# Altium schematic sheet FPGA SDRAM.SchDoc: Cart
size Tabloid; ApprovedBy: NA; CompanyName: Cospan Design LLC; DrawnBy: David McCoy; Engineer: David McCoy; DocumentNumber: 12; Revision: A; SheetNumber: 12; SheetTotal: 18; Client: OSH; Project: Guppy Buddy; ProjectPrettyName: Guppy Buddy
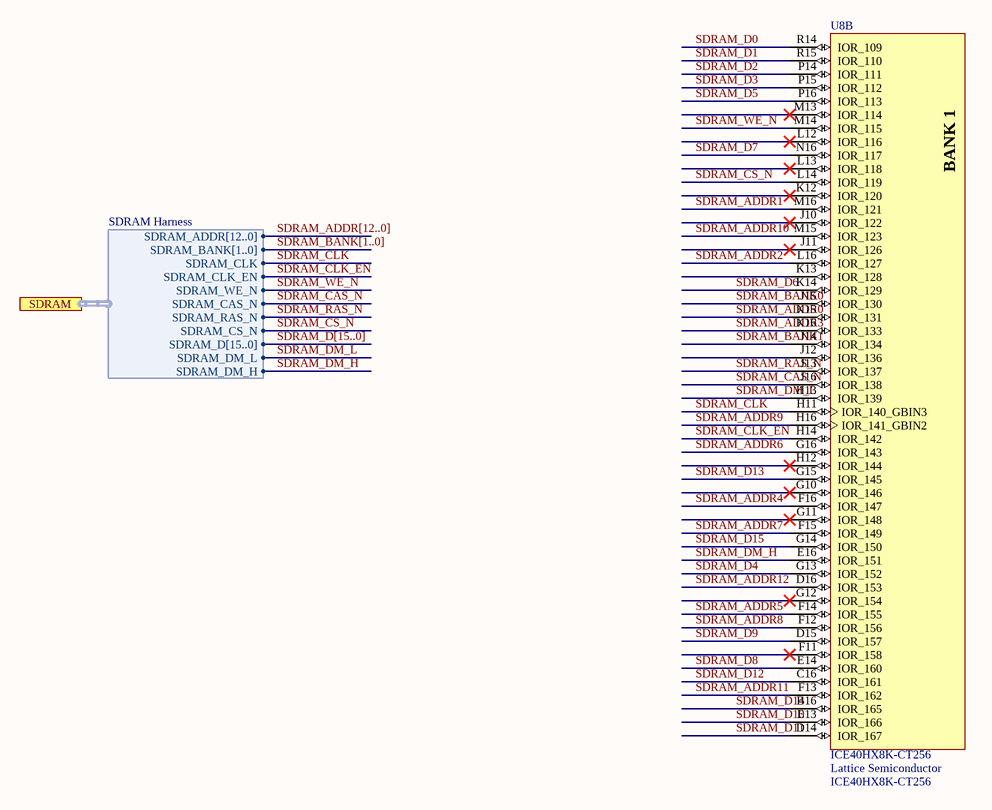
[diagram p0: FPGA SDRAM.SchDoc]

## Parts
U8  ICE40HX8K-CT256  Manufacturer 1: Lattice Semiconductor  [LATC-caBGA-256]  (part B of 5)

## Ports
SDRAM (harness SDRAM Harness)

## Harnesses
SDRAM Harness: SDRAM_ADDR[12..0], SDRAM_BANK[1..0], SDRAM_CLK, SDRAM_CLK_EN, SDRAM_WE_N, SDRAM_CAS_N, SDRAM_RAS_N, SDRAM_CS_N, SDRAM_D[15..0], SDRAM_DM_L, SDRAM_DM_H

## Nets
SDRAM_ADDR0: U8.K15(IOR_131)
SDRAM_ADDR1: U8.M16(IOR_121)
SDRAM_ADDR2: U8.L16(IOR_127)
SDRAM_ADDR3: U8.K16(IOR_133)
SDRAM_ADDR4: U8.F16(IOR_147)
SDRAM_ADDR5: U8.F14(IOR_155)
SDRAM_ADDR6: U8.G16(IOR_143)
SDRAM_ADDR7: U8.F15(IOR_149)
SDRAM_ADDR8: U8.F12(IOR_156)
SDRAM_ADDR9: U8.H16(IOR_141_GBIN2)
SDRAM_ADDR10: U8.M15(IOR_123)
SDRAM_ADDR11: U8.F13(IOR_162)
SDRAM_ADDR12: U8.D16(IOR_153)
SDRAM_BANK0: U8.J15(IOR_130)
SDRAM_BANK1: U8.J14(IOR_134)
SDRAM_CAS_N: U8.J16(IOR_138) ; port SDRAM.SDRAM_CAS_N
SDRAM_CLK: U8.H11(IOR_140_GBIN3) ; port SDRAM.SDRAM_CLK
SDRAM_CLK_EN: U8.H14(IOR_142) ; port SDRAM.SDRAM_CLK_EN
SDRAM_CS_N: U8.L14(IOR_119) ; port SDRAM.SDRAM_CS_N
SDRAM_D0: U8.R14(IOR_109)
SDRAM_D1: U8.R15(IOR_110)
SDRAM_D2: U8.P14(IOR_111)
SDRAM_D3: U8.P15(IOR_112)
SDRAM_D4: U8.G13(IOR_152)
SDRAM_D5: U8.P16(IOR_113)
SDRAM_D6: U8.K14(IOR_129)
SDRAM_D7: U8.N16(IOR_117)
SDRAM_D8: U8.E14(IOR_160)
SDRAM_D9: U8.D15(IOR_157)
SDRAM_D10: U8.E13(IOR_166)
SDRAM_D11: U8.D14(IOR_167)
SDRAM_D12: U8.C16(IOR_161)
SDRAM_D13: U8.G15(IOR_145)
SDRAM_D14: U8.B16(IOR_165)
SDRAM_D15: U8.G14(IOR_150)
SDRAM_DM_H: U8.E16(IOR_151) ; port SDRAM.SDRAM_DM_H
SDRAM_DM_L: U8.H13(IOR_139) ; port SDRAM.SDRAM_DM_L
SDRAM_RAS_N: U8.J13(IOR_137) ; port SDRAM.SDRAM_RAS_N
SDRAM_WE_N: U8.M14(IOR_115) ; port SDRAM.SDRAM_WE_N

Not connected (* = marked no-connect by the designer): U8 F11(IOR_158)* G10(IOR_146)* G11(IOR_148)* G12(IOR_154)* H12(IOR_144)* J10(IOR_122)* J11(IOR_126)* J12(IOR_136) K12(IOR_120)* K13(IOR_128) L12(IOR_116)* L13(IOR_118)* M13(IOR_114)*

## Buses and harness runs
bus SDRAM_ADDR[12..0]
bus SDRAM_BANK[1..0]
bus SDRAM_D[15..0]

## Notes on the sheet
- Project:
- http://www.cospandesign.com
- Cospan Design
- Document:
- Engineer:
- Title:
- Client:
- Approved By:
- Revision:
- Date:
- Number:
- of
- (in symbol U_ICE40HX8K-CT256, part B) BANK 1

## Library data of the parts
U8 = U_ICE40HX8K-CT256: iCE40 HX8K Series FPGA Family, 7680 Logic Cells, 1.2 V Core, 128 K Embedded RAM Bits, 256-ball caBGA, Pb-Free, Tray; Supply Voltage: 1.2V; Phase-Locked Loops: 2; Logic Cells: 7680; Embedded RAM Bits: 128K; Description 1: IC FPGA HX 7680LUTS 1.2V 256BGA; Density: 128Kb; Number of Logic Blocks (LABs): 960; Number of I/Os: 206; Min Supply Voltage: 1.14V; Max Supply Voltage: 1.26V; RAM Size: 131072b; Max Frequency: 533MHz; PackageReference: caBGA-256; PackageDescription: 256-Ball Chip Array Ball Grid Array, Body 14 x 14 mm, Pitch 0.8 mm; RoHS: TRUE; Packing: Tray; Mounting Technology: Surface Mount; ComponentLink3URL: http://www.latticesemi.com/lit/docs/package/pkg.pdf; ComponentLink1Description: Manufacturer URL; ComponentLink3Description: Package Specification; Code_JEDEC: MO-275; PackageVersion: Rev. 03.9, 02/2013; ComponentLink1URL: http://www.latticesemi.com/en; ComponentLink2URL: http://www.latticesemi.com/~/media/Documents/DataSheets/iCE/iCE40LPHXFamilyDataSheet.pdf; PartNumber: ICE40HX8K-CT256; Manufacturer: Lattice Semiconductor; ComponentLink2Description: Datasheet; DatasheetVersion: Rev. 02.9; Supplier 1: Digi-Key; Supplier Part Number 1: 220-1575-ND; Stock 1: 549; Pricing 1: 1=11.41, 25=9.898, 100=9.4536 (USD); Case/Package: BGA; Number of Pins: 256; Weight: 0.098203oz; Min Operating Temperature: -40°C; Max Operating Temperature: 85°C; Package Quantity: 119; Packaging: Tray; Operating Supply Voltage: 1.2V; Number of Gates: 7680; Number of Logic Elements/Cells: 7680; Memory Size: 128Kb; Number of Registers: 7680; Length: 14mm; Height: 17mm; Width: 14mm; Lead Free: Lead Free; ComponentLink4URL: http://www.mouser.com/ds/2/225/iCE40FamilyHandbook-311139.pdf; ComponentLink4Description: http://www.mouser.com/ds/2/225/iCE40FamilyHandbook-311139.pdf; Manufacturer Part Number 1: ICE40HX8K-CT256